# EAGLE schematic I2C-DS_Sch_v13 (EAGLE 9.7.0)
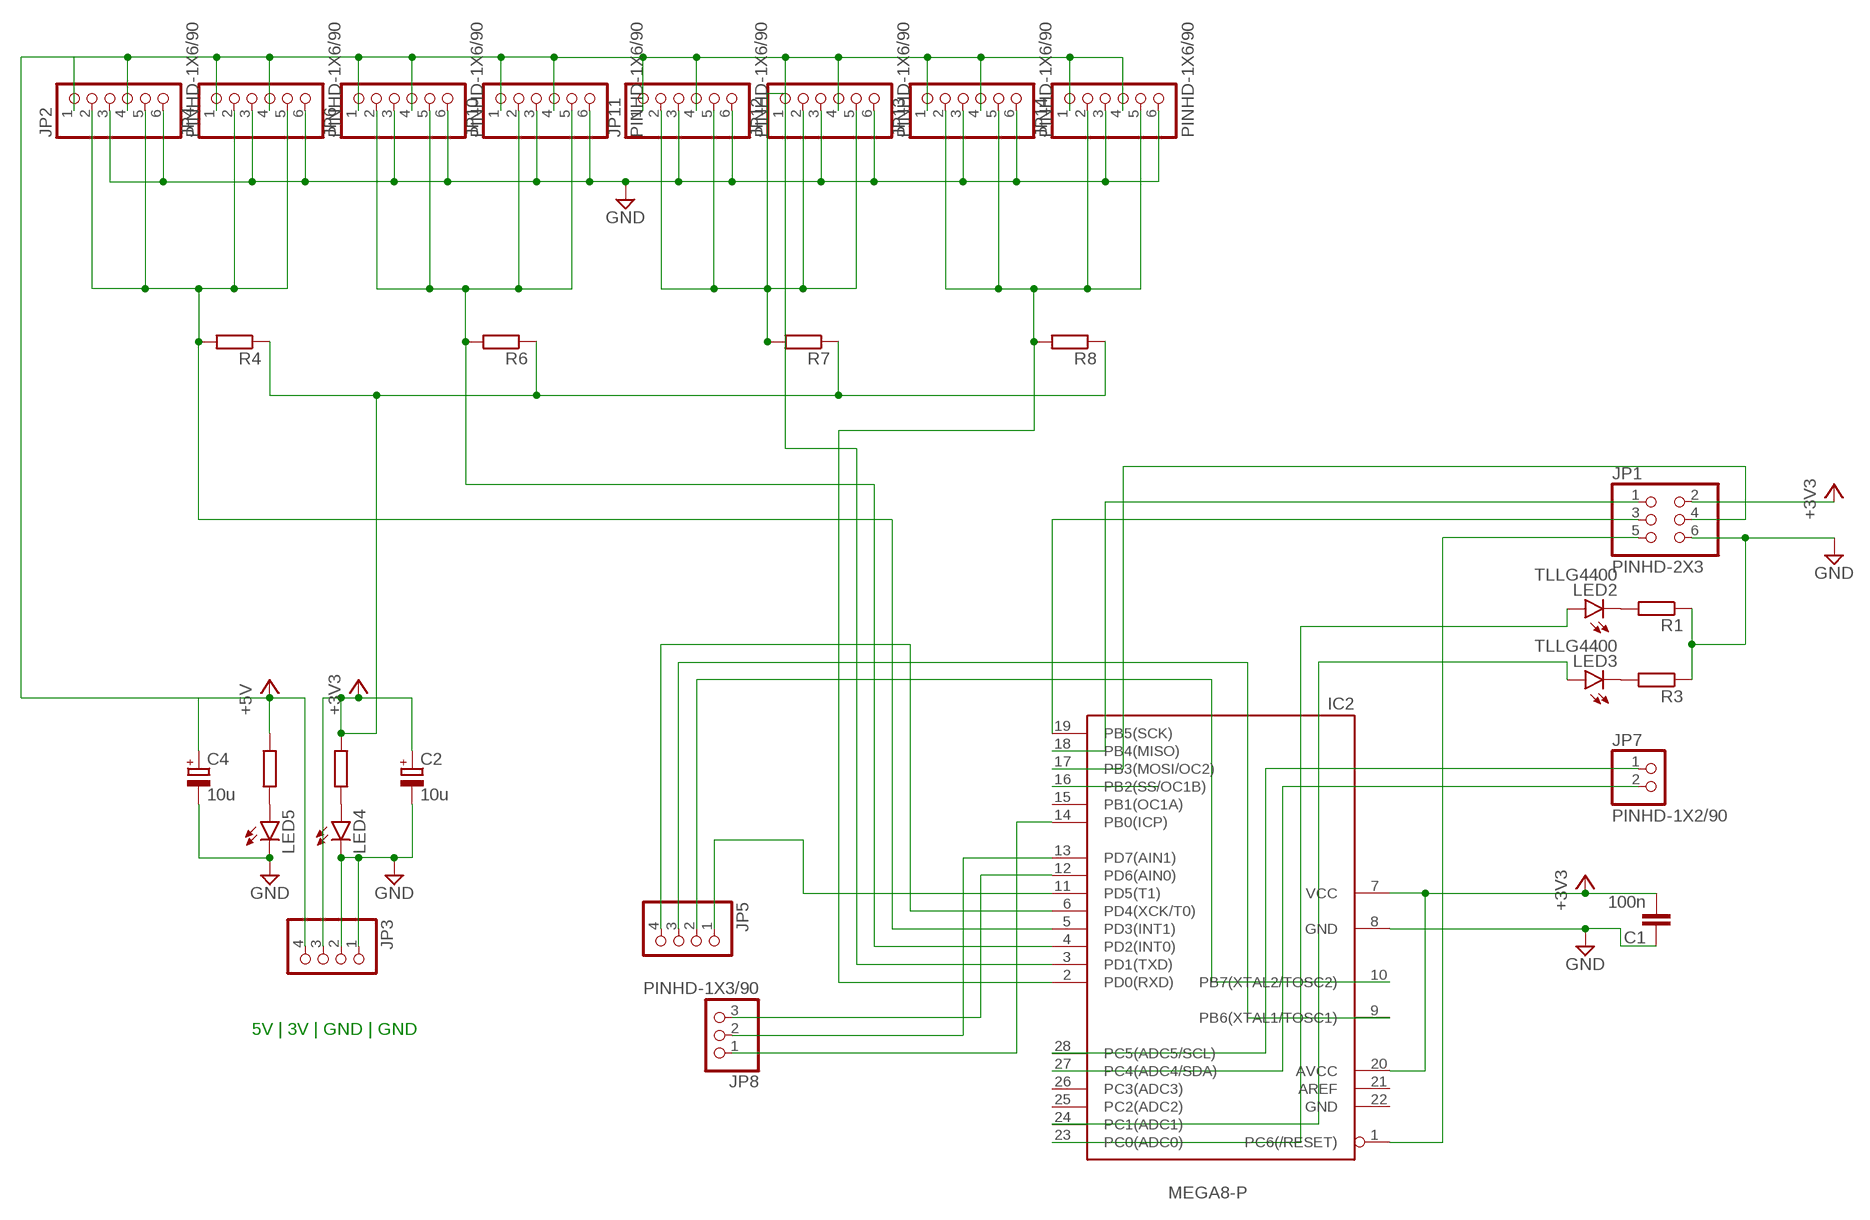
[diagram p0: schematic, sheet 1]

## Parts
C1  100n  C-EU050-030X075  [C050-030X075]
C2  10u  CPOL-EUE2.5-7  [E2,5-7]
C4  10u  CPOL-EUE2.5-7  [E2,5-7]
IC2  MEGA8-P  [DIL28-3]
JP1  PINHD-2X3  [2X03]
JP2  PINHD-1X6/90  [1X06/90]
JP3  PINHD-1X4/90  [1X04/90]
JP4  PINHD-1X6/90  [1X06/90]
JP5  PINHD-1X4/90  [1X04/90]
JP6  PINHD-1X6/90  [1X06/90]
JP7  PINHD-1X2/90  [1X02/90]
JP8  PINHD-1X3/90  [1X03/90]
JP10  PINHD-1X6/90  [1X06/90]
JP11  PINHD-1X6/90  [1X06/90]
JP12  PINHD-1X6/90  [1X06/90]
JP13  PINHD-1X6/90  [1X06/90]
JP14  PINHD-1X6/90  [1X06/90]
LED2  TLLG4400  [LED3MM]
LED3  TLLG4400  [LED3MM]
LED4  LED3MM  [LED3MM]
LED5  LED3MM  [LED3MM]
R1  R-EU_0207/10  [0207/10]
R3  R-EU_0207/10  [0207/10]
R4  R-EU_0207/10  [0207/10]
R6  R-EU_0207/10  [0207/10]
R7  R-EU_0207/10  [0207/10]
R8  R-EU_0207/10  [0207/10]
R9  R-EU_0207/10  [0207/10]
R10  R-EU_0207/10  [0207/10]

## Nets
+3V3: C1.2 C2.+ IC2.7(VCC) IC2.20(AVCC) JP1.2 JP3.3 R4.1 R6.1 R7.1 R8.1 R9.1
+5V: C4.+ JP2.1 JP2.4 JP3.4 JP4.1 JP4.4 JP6.1 JP6.4 JP10.1 JP10.4 JP11.1 JP11.4 JP12.1 JP12.4 JP13.1 JP13.4 JP14.1 JP14.4 R10.1
GND: C1.1 C2.- C4.- IC2.8(GND) JP1.6 JP2.3 JP2.6 JP3.1 JP3.2 JP4.3 JP4.6 JP6.3 JP6.6 JP10.3 JP10.6 JP11.3 JP11.6 JP12.3 JP12.6 JP13.3 JP13.6 JP14.3 JP14.6 LED4.K(C) LED5.K(C) R1.1 R3.1
N$1: IC2.23(PC0(ADC0)) LED2.A
N$2: LED2.K(C) R1.2
N$3: LED3.K(C) R3.2
N$4: IC2.3(PD1(TXD)) JP11.2 JP11.5 JP12.2 JP12.5 R7.2
N$5: IC2.2(PD0(RXD)) JP13.2 JP13.5 JP14.2 JP14.5 R8.2
N$6: LED5.A R10.2
N$7: IC2.13(PD7(AIN1)) JP8.2
N$8: IC2.1(PC6(/RESET)) JP1.5
N$9: IC2.19(PB5(SCK)) JP1.3
N$10: IC2.18(PB4(MISO)) JP1.1
N$11: IC2.17(PB3(MOSI/OC2)) JP1.4
N$12: IC2.6(PD4(XCK/T0)) JP5.4
N$13: IC2.11(PD5(T1)) JP5.1
N$14: IC2.9(PB6(XTAL1/TOSC1)) JP5.3
N$15: IC2.10(PB7(XTAL2/TOSC2)) JP5.2
N$16: IC2.27(PC4(ADC4/SDA)) JP7.2
N$17: IC2.28(PC5(ADC5/SCL)) JP7.1
N$18: IC2.16(PB2(SS/OC1B))
N$19: IC2.24(PC1(ADC1)) LED3.A
N$20: IC2.12(PD6(AIN0)) JP8.3
N$21: IC2.14(PB0(ICP)) JP8.1
N$25: LED4.A R9.2
N$31: IC2.5(PD3(INT1)) JP2.2 JP2.5 JP4.2 JP4.5 R4.2
N$34: IC2.4(PD2(INT0)) JP6.2 JP6.5 JP10.2 JP10.5 R6.2
Unconnected: IC2.15(PB1(OC1A)) IC2.21(AREF) IC2.25(PC2(ADC2)) IC2.26(PC3(ADC3))

## Notes on the sheet
- 5V | 3V | GND | GND

## Power pins joined to a net without a drawn wire
GND: IC2.22(GND)

## Library data of the parts
C1 = rcl:C-EU: CAPACITOR, European symbol; SPICEPREFIX: C
C2 C4 = rcl:CPOL-EU: POLARIZED CAPACITOR, European symbol; SPICEPREFIX: C
IC2 = atmel:MEGA8-P: MICROCONTROLLER 8 Kbytes FLASH, 1 kbytes SRAM, 512 bytes EEPROM, USART, 4-channel 10 bit ADC, 2-channel 8 bit ADC Pin compatible with Atmega48, ATMega88, ATMega168 Source: avr.lbr; OC_FARNELL: unknown; OC_NEWARK: unknown
JP1 = Connector:PINHD-2X3: PIN HEADER; CATEGORY: CONNECTOR; SUB-CATEGORY: PIN-HEADER
JP2 JP4 JP6 JP10-JP14 = Connector:PINHD-1X6: PIN HEADER; CATEGORY: CONNECTOR; SUB-CATEGORY: PIN-HEADER
JP3 JP5 = pinhead:PINHD-1X4: PIN HEADER
JP7 = Connector:PINHD-1X2: PIN HEADER; CATEGORY: CONNECTOR; SUB-CATEGORY: PIN-HEADER
JP8 = Connector:PINHD-1X3: PIN HEADER; CATEGORY: CONNECTOR; SUB-CATEGORY: PIN-HEADER
LED2 LED3 = led:TLLG4400: Low Current (2mA) LED 3 mm Tinted Diffused Package color GREEN Source: Data sheet <http://www.farnell.com/datasheets/391098.pdf>; MF: VISHAY SEMICONDUCTOR; OC_FARNELL: 1612435
LED4 LED5 = led:LED: LED OSRAM: - CHIPLED LG R971, LG N971, LY N971, LG Q971, LY Q971, LO R971, LY R971 LH N974, LH R974 LS Q976, LO Q976, LY Q976 LO Q996 - Hyper CHIPLED LW Q18S LB Q993, LB Q99A, LB R99A - SideLED LS A670, LO A670, LY A670, LG A670, LP A670 LB A673, LV A673, LT A673, LW A673 LH A674 LY A675 LS A676, LA A676, LO A676, LY A676, LW A676 LS A679, LY A679, LG A679 - Hyper Micro SIDELED® LS Y876, LA Y876, LO Y876, LY Y876 LT Y87S - SmartLED LW L88C, LW L88S LB L89C, LB L89S, LG L890 LS L89K, LO L89K, LY L89K LS L896, LA L896, LO L896, LY L896 - TOPLED LS T670, LO T670, LY T670, LG T670, LP T670 LSG T670, LSP T670, LSY T670, LOP T670, LYG T670 LG T671, LOG T671, LSG T671 LB T673, LV T673, LT T673, LW T673 LH T674 LS T676, LA T676, LO T676, LY T676, LB T676, LH T676, LSB T676, LW T676 LB T67C, LV T67C, LT T67C, LS T67K, LO T67K, LY T67K, LW E67C LS E67B, LA E67B, LO E67B, LY E67B, LB E67C, LV E67C, LT E67C LW T67C LS T679, LY T679, LG T679 LS T770, LO T770, LY T770, LG T770, LP T770 LB T773, LV T773, LT T773, LW T773 LH T774 LS E675, LA E675, LY E675, LS T675 LS T776, LA T776, LO T776, LY T776, LB T776 LHGB T686 LT T68C, LB T68C - Hyper Mini TOPLED® LB M676 - Mini TOPLED Santana® LG M470 LS M47K, LO M47K, LY M47K Source: http://www.osram.convergy.de LUXEON: - LUMILED® LXK2-PW12-R00, LXK2-PW12-S00, LXK2-PW14-U00, LXK2-PW14-V00 LXK2-PM12-R00, LXK2-PM12-S00, LXK2-PM14-U00 LXK2-PE12-Q00, LXK2-PE12-R00, LXK2-PE12-S00, LXK2-PE14-T00, LXK2-PE14-U00 LXK2-PB12-K00, LXK2-PB12-L00, LXK2-PB12-M00, LXK2-PB14-N00, LXK2-PB14-P00, LXK2-PB14-Q00 LXK2-PR12-L00, LXK2-PR12-M00, LXK2-PR14-Q00, LXK2-PR14-R00 LXK2-PD12-Q00, LXK2-PD12-R00, LXK2-PD12-S00 LXK2-PH12-R00, LXK2-PH12-S00 LXK2-PL12-P00, LXK2-PL12-Q00, LXK2-PL12-R00 Source: www.luxeon.com KINGBRIGHT: KA-3528ASYC Source: www.kingbright.com
R1 R3 R4 R6-R10 = rcl:R-EU_: RESISTOR, European symbol; SPICEPREFIX: R